# EAGLE design DS18B20_breakout (EAGLE 7.5.0)
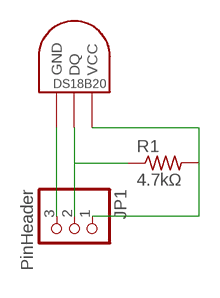
[diagram p0: schematic, sheet 1]

## Parts
JP1  PinHeader  PINHD-1X3  [1X03]
R1  4.7kΩ  R-US_0207/7  [0207/7]
U$1  DS1820TO92  [DS1820]

## Nets
N$1: JP1.3 U$1.GND
N$2: JP1.2 R1.1 U$1.DQ
N$3: JP1.1 R1.2 U$1.VDD(VCC)

## Library data of the parts
JP1 = pinhead:PINHD-1X3: PIN HEADER
R1 = resistor:R-US_: RESISTOR, American symbol
U$1 = Ava:DS1820: DS18B20 Programmable Resolution 1-Wire Digital Thermometer Description The DS18B20 digital thermometer provides 9-bit to 12-bit Celsius temperature measurements and has an alarm function with nonvolatile user-programmable upper and lower trigger points. The DS18B20 communicates over a 1-Wire® bus that by definition requires only one data line (and ground) for communication with a central microprocessor. It has an operating temperature range of -55°C to +125°C and is accurate to ±0.5°C over the range of -10°C to +85°C. In addition, the DS18B20 can derive power directly from the data line ("parasite power"), eliminating the need for an external power supply. Each DS18B20 has a unique 64-bit serial code, which allows multiple DS18B20s to function on the same 1-Wire bus. Thus, it is simple to use one microprocessor to control many DS18B20s distributed over a large area. Applications that can benefit from this feature include HVAC environmental controls, temperature monitoring systems inside buildings, equipment, or machinery, and process monitoring and control systems.

## Board
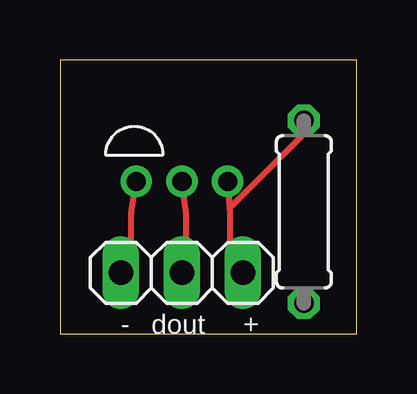
[diagram p1: board, top side]
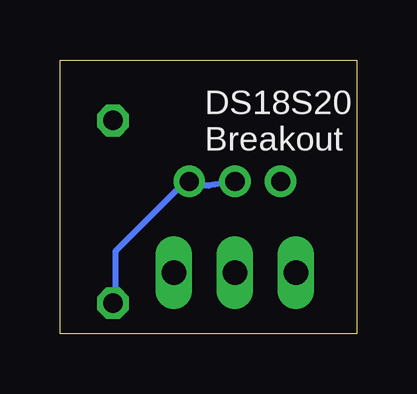
[diagram p2: board, bottom side, seen from below]

Size 12.37 x 11.42 mm. Coordinates in mm from the lower left corner, seen from the top.
Outline: 0,0 12.37,0 12.37,11.42 0,11.42 0,0
Copper layers (1*16): Top 0.035mm / dielectric 1.5mm / Bottom 0.035mm
Design rules "default": minimum track width 10mil, minimum drill 24mil, track to track 8mil, track to pad 8mil, pad to pad 8mil, via to via 8mil, smd to smd 8mil, copper to edge 40mil, drill to drill 8mil, minimum pad ring 10mil, minimum via ring 8mil, stop-mask expansion 4mil, vias tented up to drill 0mil, thermal gap 10mil

### Footprints (pad centres in the part's own frame; a part is rotated, then mirrored left to right if it is on the bottom)
1X03 = drill 1.016 long: 1 -2.54,0; 2 0,0; 3 2.54,0
0207/7 = drill 0.813 octagon: 1 -3.81,0; 2 3.81,0
DS1820 = drill 0.8: DQ 2.54,-1.27; GND 0.635,-1.27; VDD 4.445,-1.27

### Placement (x,y rotation side)
JP1  5.08,2.54 180 top
R1  10.16,5.08 90 top
U$1  2.54,7.62 0 top

### Tracks (layer width: path | path; a pad name or v marks a point on that pad's centre or on a via)
N$1
  Top 0.254: JP1.3 2.97,2.97 2.97,5.03 U$1.GND
N$2
  Top 0.254: U$1.DQ 5.26,5.03 5.26,2.74 JP1.2
  Bottom 0.254: U$1.DQ 6.17,6.17 7.32,6.17 10.06,3.43 10.06,1.37 R1.1
N$3
  Top 0.254: JP1.1 7.54,2.74 7.09,3.2 7.09,5.03 U$1.VDD 7.09,5.26 10.06,8.23 10.06,8.69 R1.2

### Text on the board
_tsilk: - | dout | +
_bsilk: DS18S20 / Breakout